# Altium schematic sheet keymap.SchDoc: Keymap Layout
size A3; Author: Daniele Basile <asterix24@gmail.com>; Organization: Altium Limited; Address1: L3, 12a Rodborough Rd; Address2: Frenchs Forest; Address3: NSW; Address4: Australia 2086; DocumentNumber: 1; Revision: Rev.A; SheetNumber: 1; SheetTotal: 2
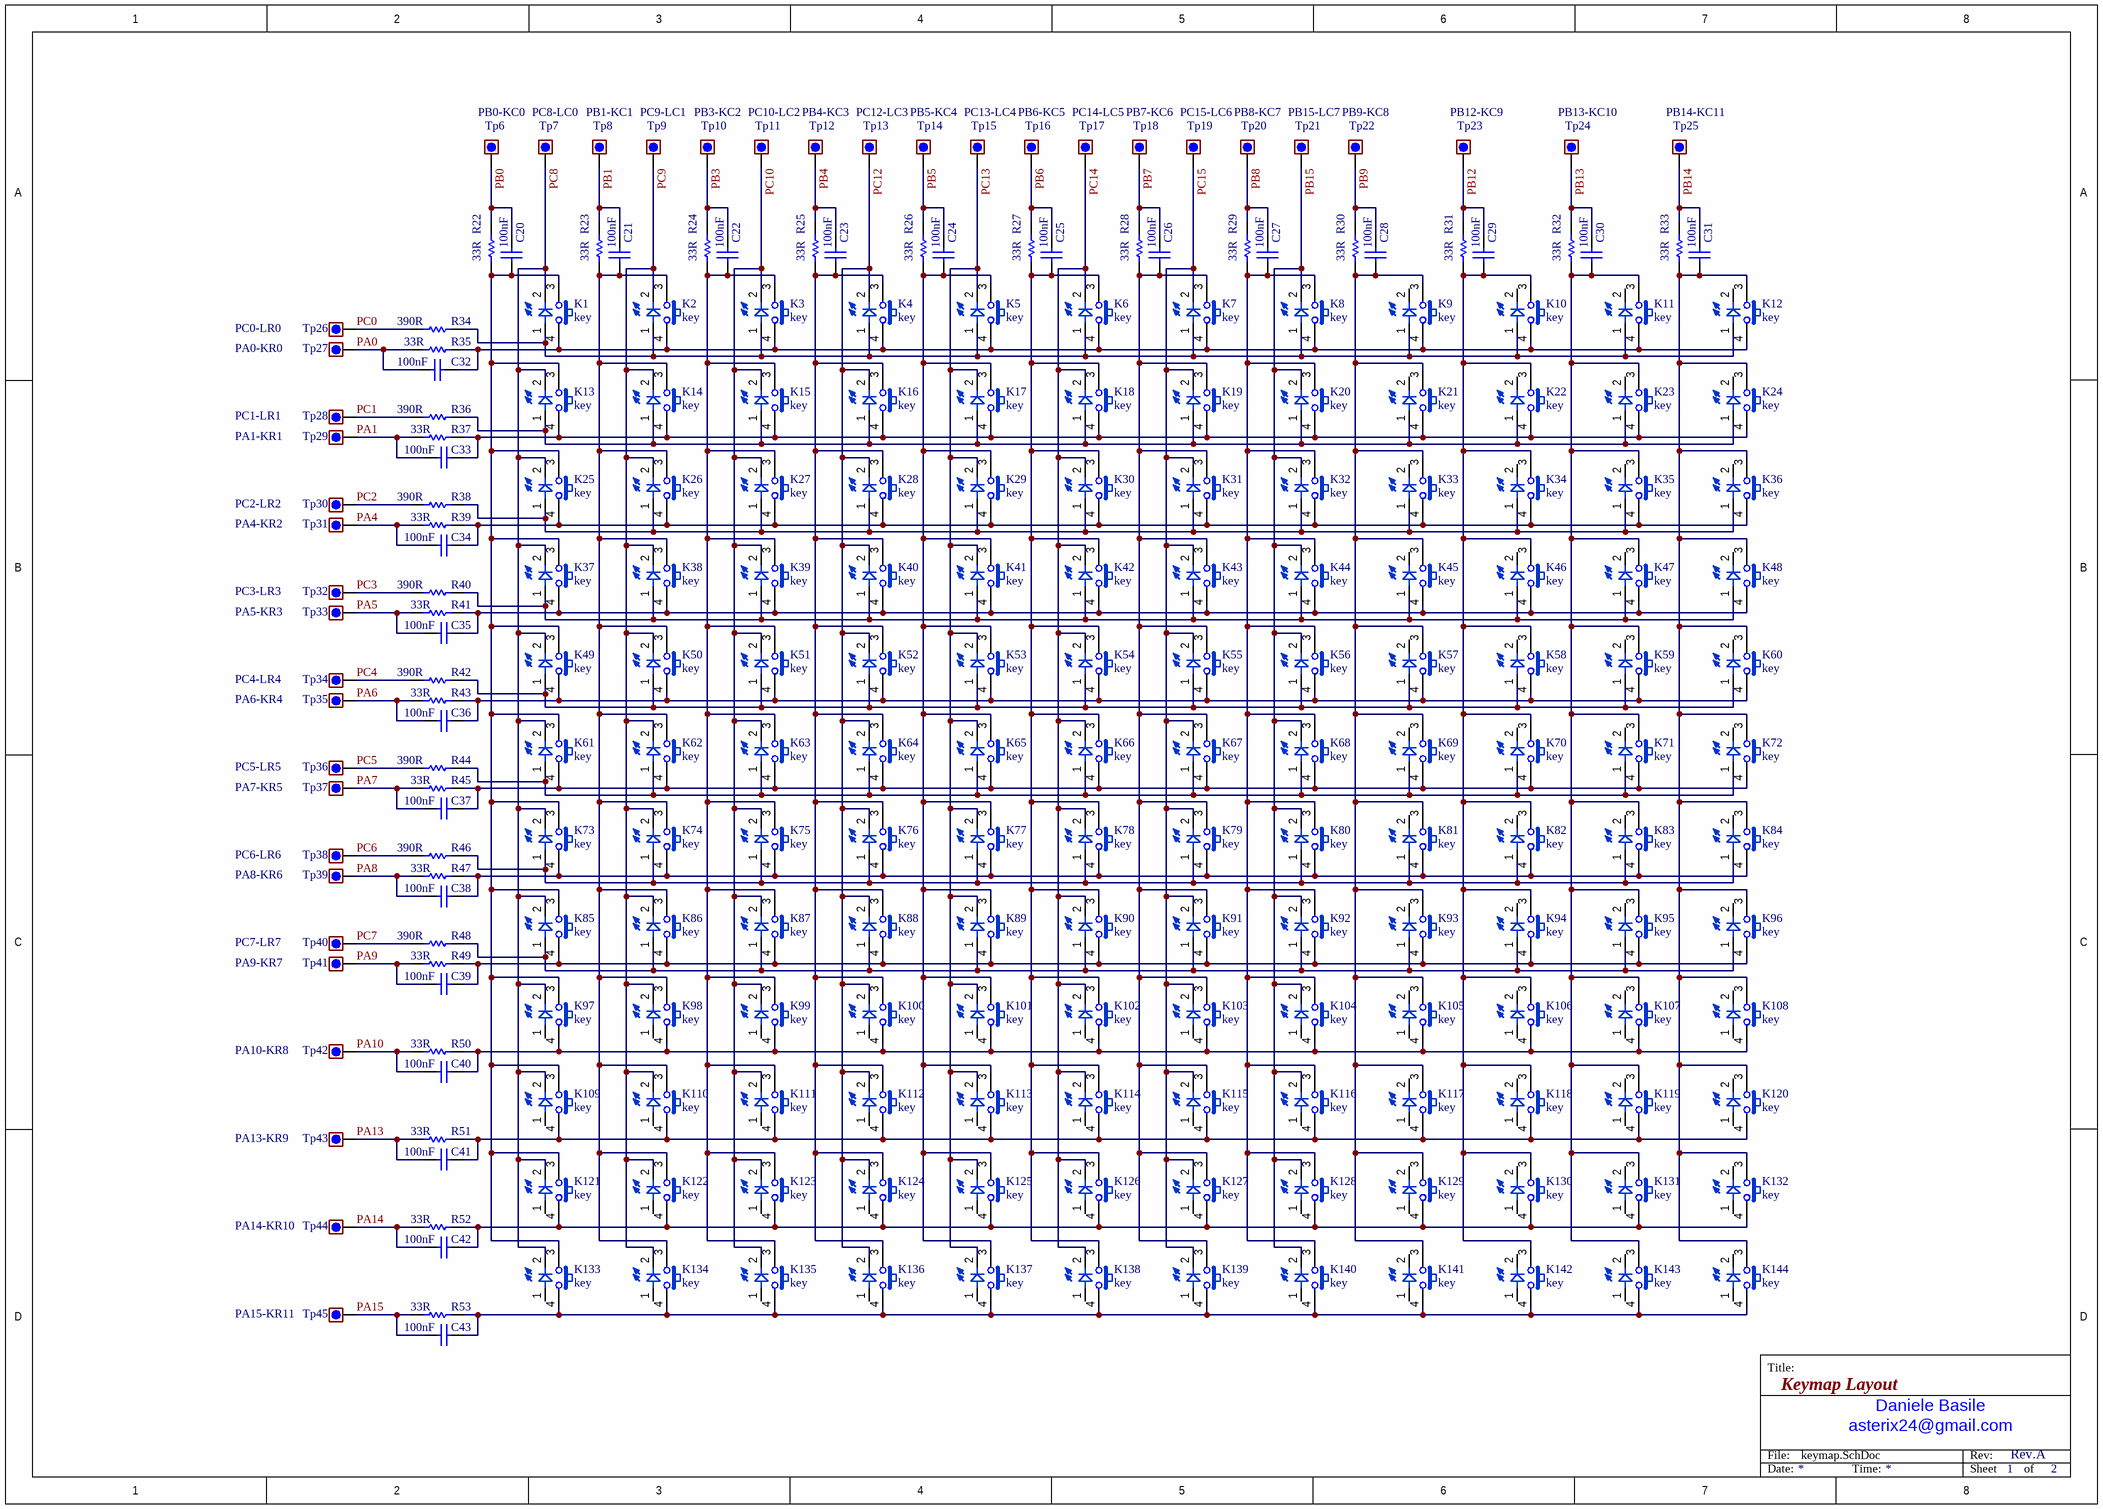
[diagram p0: keymap.SchDoc]

## Parts
C20  100nF  [0603_[1608]]
C21  100nF  [0603_[1608]]
C22  100nF  [0603_[1608]]
C23  100nF  [0603_[1608]]
C24  100nF  [0603_[1608]]
C25  100nF  [0603_[1608]]
C26  100nF  [0603_[1608]]
C27  100nF  [0603_[1608]]
C28  100nF  [0603_[1608]]
C29  100nF  [0603_[1608]]
C30  100nF  [0603_[1608]]
C31  100nF  [0603_[1608]]
C32  100nF  [0603_[1608]]
C33  100nF  [0603_[1608]]
C34  100nF  [0603_[1608]]
C35  100nF  [0603_[1608]]
C36  100nF  [0603_[1608]]
C37  100nF  [0603_[1608]]
C38  100nF  [0603_[1608]]
C39  100nF  [0603_[1608]]
C40  100nF  [0603_[1608]]
C41  100nF  [0603_[1608]]
C42  100nF  [0603_[1608]]
C43  100nF  [0603_[1608]]
K1  key
K2  key
K3  key
K4  key
K5  key
K6  key
K7  key
K8  key
K9  key
K10  key
K11  key
K12  key
K13  key
K14  key
K15  key
K16  key
K17  key
K18  key
K19  key
K20  key
K21  key
K22  key
K23  key
K24  key
K25  key
K26  key
K27  key
K28  key
K29  key
K30  key
K31  key
K32  key
K33  key
K34  key
K35  key
K36  key
K37  key
K38  key
K39  key
K40  key
K41  key
K42  key
K43  key
K44  key
K45  key
K46  key
K47  key
K48  key
K49  key
K50  key
K51  key
K52  key
K53  key
K54  key
K55  key
K56  key
K57  key
K58  key
K59  key
K60  key
K61  key
K62  key
K63  key
K64  key
K65  key
K66  key
K67  key
K68  key
K69  key
K70  key
K71  key
K72  key
K73  key
K74  key
K75  key
K76  key
K77  key
K78  key
K79  key
K80  key
K81  key
K82  key
K83  key
K84  key
K85  key
K86  key
K87  key
K88  key
K89  key
K90  key
K91  key
K92  key
K93  key
K94  key
K95  key
K96  key
K97  key
K98  key
K99  key
K100  key
K101  key
K102  key
K103  key
K104  key
K105  key
K106  key
K107  key
K108  key
K109  key
K110  key
K111  key
K112  key
K113  key
K114  key
K115  key
K116  key
K117  key
K118  key
K119  key
K120  key
K121  key
K122  key
K123  key
K124  key
K125  key
K126  key
K127  key
K128  key
K129  key
K130  key
K131  key
K132  key
K133  key
K134  key
K135  key
K136  key
K137  key
K138  key
K139  key
K140  key
K141  key
K142  key
K143  key
K144  key
R22  33R  [0402_[1005]]
R23  33R  [0402_[1005]]
R24  33R  [0402_[1005]]
R25  33R  [0402_[1005]]
R26  33R  [0402_[1005]]
R27  33R  [0402_[1005]]
R28  33R  [0402_[1005]]
R29  33R  [0402_[1005]]
R30  33R  [0402_[1005]]
R31  33R  [0402_[1005]]
R32  33R  [0402_[1005]]
R33  33R  [0402_[1005]]
R34  390R  [0402_[1005]]
R35  33R  [0402_[1005]]
R36  390R  [0402_[1005]]
R37  33R  [0402_[1005]]
R38  390R  [0402_[1005]]
R39  33R  [0402_[1005]]
R40  390R  [0402_[1005]]
R41  33R  [0402_[1005]]
R42  390R  [0402_[1005]]
R43  33R  [0402_[1005]]
R44  390R  [0402_[1005]]
R45  33R  [0402_[1005]]
R46  390R  [0402_[1005]]
R47  33R  [0402_[1005]]
R48  390R  [0402_[1005]]
R49  33R  [0402_[1005]]
R50  33R  [0402_[1005]]
R51  33R  [0402_[1005]]
R52  33R  [0402_[1005]]
R53  33R  [0402_[1005]]
Tp6  PB0-KC0  [TEST_POINT_THD_D1.8MM]  (no BOM)
Tp7  PC8-LC0  [TEST_POINT_THD_D1.8MM]  (no BOM)
Tp8  PB1-KC1  [TEST_POINT_THD_D1.8MM]  (no BOM)
Tp9  PC9-LC1  [TEST_POINT_THD_D1.8MM]  (no BOM)
Tp10  PB3-KC2  [TEST_POINT_THD_D1.8MM]  (no BOM)
Tp11  PC10-LC2  [TEST_POINT_THD_D1.8MM]  (no BOM)
Tp12  PB4-KC3  [TEST_POINT_THD_D1.8MM]  (no BOM)
Tp13  PC12-LC3  [TEST_POINT_THD_D1.8MM]  (no BOM)
Tp14  PB5-KC4  [TEST_POINT_THD_D1.8MM]  (no BOM)
Tp15  PC13-LC4  [TEST_POINT_THD_D1.8MM]  (no BOM)
Tp16  PB6-KC5  [TEST_POINT_THD_D1.8MM]  (no BOM)
Tp17  PC14-LC5  [TEST_POINT_THD_D1.8MM]  (no BOM)
Tp18  PB7-KC6  [TEST_POINT_THD_D1.8MM]  (no BOM)
Tp19  PC15-LC6  [TEST_POINT_THD_D1.8MM]  (no BOM)
Tp20  PB8-KC7  [TEST_POINT_THD_D1.8MM]  (no BOM)
Tp21  PB15-LC7  [TEST_POINT_THD_D1.8MM]  (no BOM)
Tp22  PB9-KC8  [TEST_POINT_THD_D1.8MM]  (no BOM)
Tp23  PB12-KC9  [TEST_POINT_THD_D1.8MM]  (no BOM)
Tp24  PB13-KC10  [TEST_POINT_THD_D1.8MM]  (no BOM)
Tp25  PB14-KC11  [TEST_POINT_THD_D1.8MM]  (no BOM)
Tp26  PC0-LR0  [TEST_POINT_THD_D1.8MM]  (no BOM)
Tp27  PA0-KR0  [TEST_POINT_THD_D1.8MM]  (no BOM)
Tp28  PC1-LR1  [TEST_POINT_THD_D1.8MM]  (no BOM)
Tp29  PA1-KR1  [TEST_POINT_THD_D1.8MM]  (no BOM)
Tp30  PC2-LR2  [TEST_POINT_THD_D1.8MM]  (no BOM)
Tp31  PA4-KR2  [TEST_POINT_THD_D1.8MM]  (no BOM)
Tp32  PC3-LR3  [TEST_POINT_THD_D1.8MM]  (no BOM)
Tp33  PA5-KR3  [TEST_POINT_THD_D1.8MM]  (no BOM)
Tp34  PC4-LR4  [TEST_POINT_THD_D1.8MM]  (no BOM)
Tp35  PA6-KR4  [TEST_POINT_THD_D1.8MM]  (no BOM)
Tp36  PC5-LR5  [TEST_POINT_THD_D1.8MM]  (no BOM)
Tp37  PA7-KR5  [TEST_POINT_THD_D1.8MM]  (no BOM)
Tp38  PC6-LR6  [TEST_POINT_THD_D1.8MM]  (no BOM)
Tp39  PA8-KR6  [TEST_POINT_THD_D1.8MM]  (no BOM)
Tp40  PC7-LR7  [TEST_POINT_THD_D1.8MM]  (no BOM)
Tp41  PA9-KR7  [TEST_POINT_THD_D1.8MM]  (no BOM)
Tp42  PA10-KR8  [TEST_POINT_THD_D1.8MM]  (no BOM)
Tp43  PA13-KR9  [TEST_POINT_THD_D1.8MM]  (no BOM)
Tp44  PA14-KR10  [TEST_POINT_THD_D1.8MM]  (no BOM)
Tp45  PA15-KR11  [TEST_POINT_THD_D1.8MM]  (no BOM)

## Nets
PA0: C32.1 R35.1 Tp27.1
PA1: C33.1 R37.1 Tp29.1
PA4: C34.1 R39.1 Tp31.1
PA5: C35.1 R41.1 Tp33.1
PA6: C36.1 R43.1 Tp35.1
PA7: C37.1 R45.1 Tp37.1
PA8: C38.1 R47.1 Tp39.1
PA9: C39.1 R49.1 Tp41.1
PA10: C40.1 R50.1 Tp42.1
PA13: C41.1 R51.1 Tp43.1
PA14: C42.1 R52.1 Tp44.1
PA15: C43.1 R53.1 Tp45.1
PB0: C20.1 R22.1 Tp6.1
PB1: C21.1 R23.1 Tp8.1
PB3: C22.1 R24.1 Tp10.1
PB4: C23.1 R25.1 Tp12.1
PB5: C24.1 R26.1 Tp14.1
PB6: C25.1 R27.1 Tp16.1
PB7: C26.1 R28.1 Tp18.1
PB8: C27.1 R29.1 Tp20.1
PB9: C28.1 R30.1 Tp22.1
PB12: C29.1 R31.1 Tp23.1
PB13: C30.1 R32.1 Tp24.1
PB14: C31.1 R33.1 Tp25.1
PB15: K8.2 K20.2 K32.2 K44.2 K56.2 K68.2 K80.2 K92.2 K104.2 K116.2 K128.2 K140.2 Tp21.1
PC0: R34.1 Tp26.1
PC1: R36.1 Tp28.1
PC2: R38.1 Tp30.1
PC3: R40.1 Tp32.1
PC4: R42.1 Tp34.1
PC5: R44.1 Tp36.1
PC6: R46.1 Tp38.1
PC7: R48.1 Tp40.1
PC8: K1.2 K13.2 K25.2 K37.2 K49.2 K61.2 K73.2 K85.2 K97.2 K109.2 K121.2 K133.2 Tp7.1
PC9: K2.2 K14.2 K26.2 K38.2 K50.2 K62.2 K74.2 K86.2 K98.2 K110.2 K122.2 K134.2 Tp9.1
PC10: K3.2 K15.2 K27.2 K39.2 K51.2 K63.2 K75.2 K87.2 K99.2 K111.2 K123.2 K135.2 Tp11.1
PC12: K4.2 K16.2 K28.2 K40.2 K52.2 K64.2 K76.2 K88.2 K100.2 K112.2 K124.2 K136.2 Tp13.1
PC13: K5.2 K17.2 K29.2 K41.2 K53.2 K65.2 K77.2 K89.2 K101.2 K113.2 K125.2 K137.2 Tp15.1
PC14: K6.2 K18.2 K30.2 K42.2 K54.2 K66.2 K78.2 K90.2 K102.2 K114.2 K126.2 K138.2 Tp17.1
PC15: K7.2 K19.2 K31.2 K43.2 K55.2 K67.2 K79.2 K91.2 K103.2 K115.2 K127.2 K139.2 Tp19.1
NetC20_2: C20.2 K1.3 K13.3 K25.3 K37.3 K49.3 K61.3 K73.3 K85.3 K97.3 K109.3 K121.3 K133.3 R22.2
NetC21_2: C21.2 K2.3 K14.3 K26.3 K38.3 K50.3 K62.3 K74.3 K86.3 K98.3 K110.3 K122.3 K134.3 R23.2
NetC22_2: C22.2 K3.3 K15.3 K27.3 K39.3 K51.3 K63.3 K75.3 K87.3 K99.3 K111.3 K123.3 K135.3 R24.2
NetC23_2: C23.2 K4.3 K16.3 K28.3 K40.3 K52.3 K64.3 K76.3 K88.3 K100.3 K112.3 K124.3 K136.3 R25.2
NetC24_2: C24.2 K5.3 K17.3 K29.3 K41.3 K53.3 K65.3 K77.3 K89.3 K101.3 K113.3 K125.3 K137.3 R26.2
NetC25_2: C25.2 K6.3 K18.3 K30.3 K42.3 K54.3 K66.3 K78.3 K90.3 K102.3 K114.3 K126.3 K138.3 R27.2
NetC26_2: C26.2 K7.3 K19.3 K31.3 K43.3 K55.3 K67.3 K79.3 K91.3 K103.3 K115.3 K127.3 K139.3 R28.2
NetC27_2: C27.2 K8.3 K20.3 K32.3 K44.3 K56.3 K68.3 K80.3 K92.3 K104.3 K116.3 K128.3 K140.3 R29.2
NetC28_2: C28.2 K9.3 K21.3 K33.3 K45.3 K57.3 K69.3 K81.3 K93.3 K105.3 K117.3 K129.3 K141.3 R30.2
NetC29_2: C29.2 K10.3 K22.3 K34.3 K46.3 K58.3 K70.3 K82.3 K94.3 K106.3 K118.3 K130.3 K142.3 R31.2
NetC30_2: C30.2 K11.3 K23.3 K35.3 K47.3 K59.3 K71.3 K83.3 K95.3 K107.3 K119.3 K131.3 K143.3 R32.2
NetC31_2: C31.2 K12.3 K24.3 K36.3 K48.3 K60.3 K72.3 K84.3 K96.3 K108.3 K120.3 K132.3 K144.3 R33.2
NetC32_2: C32.2 K1.4 K2.4 K3.4 K4.4 K5.4 K6.4 K7.4 K8.4 K9.4 K10.4 K11.4 K12.4 R35.2
NetC33_2: C33.2 K13.4 K14.4 K15.4 K16.4 K17.4 K18.4 K19.4 K20.4 K21.4 K22.4 K23.4 K24.4 R37.2
NetC34_2: C34.2 K25.4 K26.4 K27.4 K28.4 K29.4 K30.4 K31.4 K32.4 K33.4 K34.4 K35.4 K36.4 R39.2
NetC35_2: C35.2 K37.4 K38.4 K39.4 K40.4 K41.4 K42.4 K43.4 K44.4 K45.4 K46.4 K47.4 K48.4 R41.2
NetC36_2: C36.2 K49.4 K50.4 K51.4 K52.4 K53.4 K54.4 K55.4 K56.4 K57.4 K58.4 K59.4 K60.4 R43.2
NetC37_2: C37.2 K61.4 K62.4 K63.4 K64.4 K65.4 K66.4 K67.4 K68.4 K69.4 K70.4 K71.4 K72.4 R45.2
NetC38_2: C38.2 K73.4 K74.4 K75.4 K76.4 K77.4 K78.4 K79.4 K80.4 K81.4 K82.4 K83.4 K84.4 R47.2
NetC39_2: C39.2 K85.4 K86.4 K87.4 K88.4 K89.4 K90.4 K91.4 K92.4 K93.4 K94.4 K95.4 K96.4 R49.2
NetC40_2: C40.2 K97.4 K98.4 K99.4 K100.4 K101.4 K102.4 K103.4 K104.4 K105.4 K106.4 K107.4 K108.4 R50.2
NetC41_2: C41.2 K109.4 K110.4 K111.4 K112.4 K113.4 K114.4 K115.4 K116.4 K117.4 K118.4 K119.4 K120.4 R51.2
NetC42_2: C42.2 K121.4 K122.4 K123.4 K124.4 K125.4 K126.4 K127.4 K128.4 K129.4 K130.4 K131.4 K132.4 R52.2
NetC43_2: C43.2 K133.4 K134.4 K135.4 K136.4 K137.4 K138.4 K139.4 K140.4 K141.4 K142.4 K143.4 K144.4 R53.2
NetK1_1: K1.1 K2.1 K3.1 K4.1 K5.1 K6.1 K7.1 K8.1 K9.1 K10.1 K11.1 K12.1 R34.2
NetK13_1: K13.1 K14.1 K15.1 K16.1 K17.1 K18.1 K19.1 K20.1 K21.1 K22.1 K23.1 K24.1 R36.2
NetK25_1: K25.1 K26.1 K27.1 K28.1 K29.1 K30.1 K31.1 K32.1 K33.1 K34.1 K35.1 K36.1 R38.2
NetK37_1: K37.1 K38.1 K39.1 K40.1 K41.1 K42.1 K43.1 K44.1 K45.1 K46.1 K47.1 K48.1 R40.2
NetK49_1: K49.1 K50.1 K51.1 K52.1 K53.1 K54.1 K55.1 K56.1 K57.1 K58.1 K59.1 K60.1 R42.2
NetK61_1: K61.1 K62.1 K63.1 K64.1 K65.1 K66.1 K67.1 K68.1 K69.1 K70.1 K71.1 K72.1 R44.2
NetK73_1: K73.1 K74.1 K75.1 K76.1 K77.1 K78.1 K79.1 K80.1 K81.1 K82.1 K83.1 K84.1 R46.2
NetK85_1: K85.1 K86.1 K87.1 K88.1 K89.1 K90.1 K91.1 K92.1 K93.1 K94.1 K95.1 K96.1 R48.2

Not connected (* = marked no-connect by the designer): K9 2; K10 2; K11 2; K12 2; K21 2; K22 2; K23 2; K24 2; K33 2; K34 2; K35 2; K36 2; K45 2; K46 2; K47 2; K48 2; K57 2; K58 2; K59 2; K60 2; K69 2; K70 2; K71 2; K72 2; K81 2; K82 2; K83 2; K84 2; K93 2; K94 2; K95 2; K96 2; K97 1; K98 1; K99 1; K100 1; K101 1; K102 1; K103 1; K104 1; K105 1 2; K106 1 2; K107 1 2; K108 1 2; K109 1; K110 1; K111 1; K112 1; K113 1; K114 1; K115 1; K116 1; K117 1 2; K118 1 2; K119 1 2; K120 1 2; K121 1; K122 1; K123 1; K124 1; K125 1; K126 1; K127 1; K128 1; K129 1 2; K130 1 2; K131 1 2; K132 1 2; K133 1; K134 1; K135 1; K136 1; K137 1; K138 1; K139 1; K140 1; K141 1 2; K142 1 2; K143 1 2; K144 1 2

## Notes on the sheet
- Title:
- File:
- asterix24@gmail.com
- Daniele Basile
- Rev:
- Date:
- Time:
- Sheet
- of

## Library data of the parts
C20-C43 = Cap: Ceramic X7R 50V; Value: 10nF; Published: 8-Jun-2000; Revision: July-2002: Re-released for DXP Platform.; Publisher: Altium Limited
K1-K144 = keybutton_cherryMX: CherryMx key button.
R22-R53 = Res1: Resistor; Value: 1K; Published: 8-Jun-2000; Revision: July-2002: Re-released for DXP Platform.; Publisher: Altium Limited
Tp6-Tp45 = Test_point: Test point